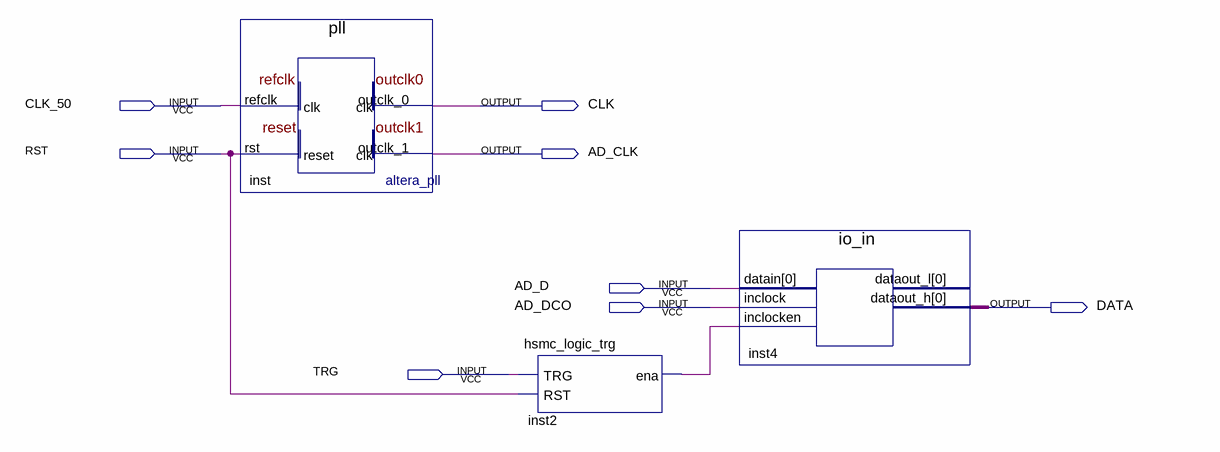
[diagram p0: schematic sheet]
// Quartus schematic hsmc_2.bdf as structural Verilog: 3 symbols, 8 pins
module hsmc_2 (
  input  CLK_50,
  input  RST,
  input  AD_D,
  input  AD_DCO,
  input  TRG,
  output CLK,
  output AD_CLK,
  output DATA
);

  wire inst2_ena;

  pll inst (.refclk(CLK_50), .rst(RST), .outclk_0(CLK), .outclk_1(AD_CLK));
  hsmc_logic_trg inst2 (.TRG(TRG), .RST(RST), .ena(inst2_ena));
  io_in inst4 (.datain(AD_D), .inclock(AD_DCO), .inclocken(inst2_ena), .dataout_h(DATA));  // open: dataout_l
endmodule
